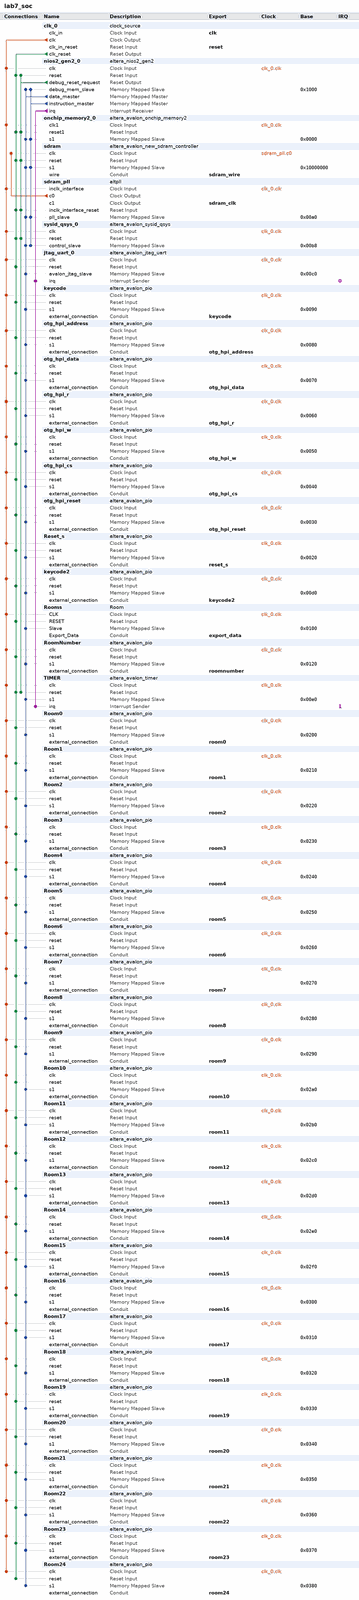
[diagram p0: system contents, whole]
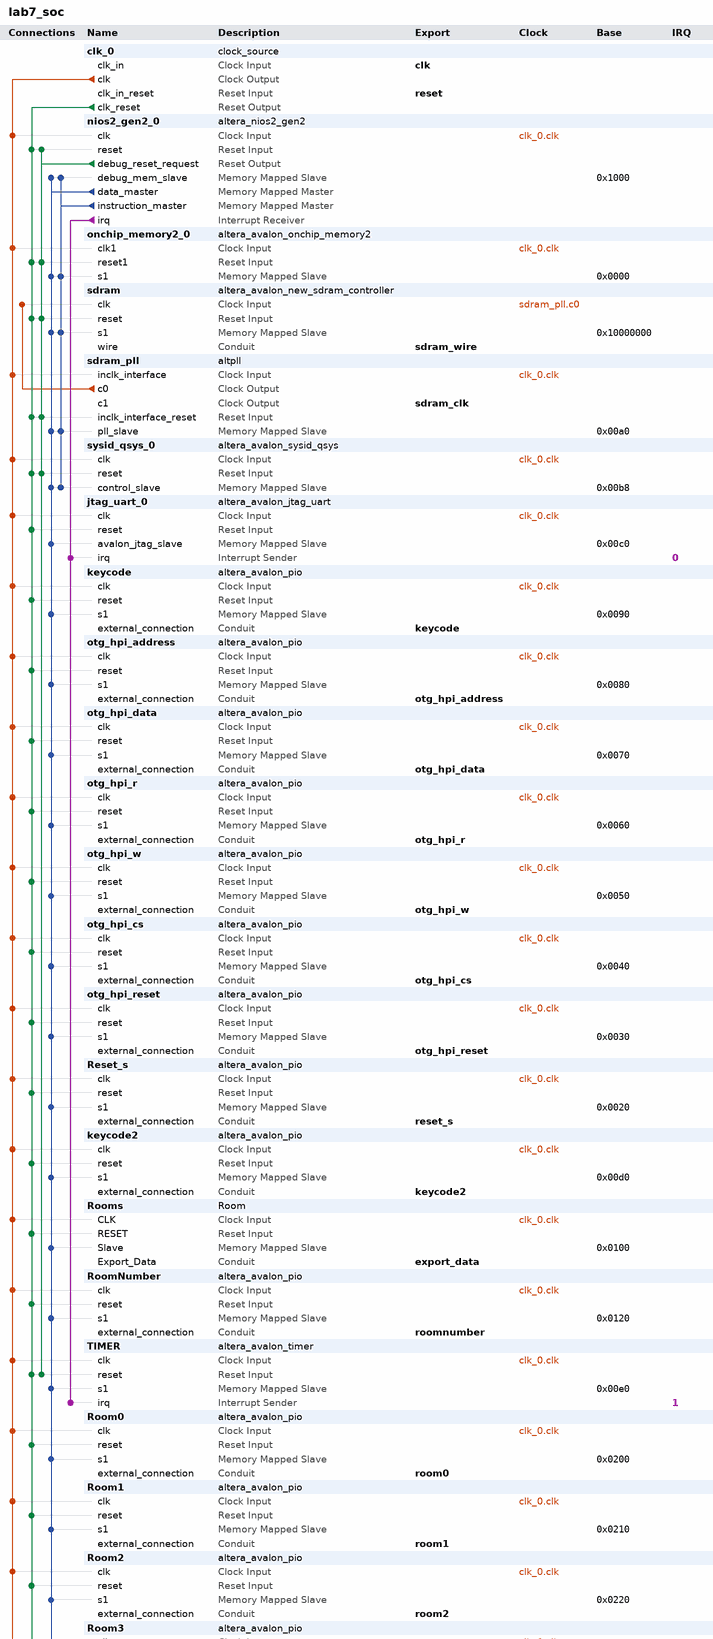
[diagram p1: system contents, upper part]
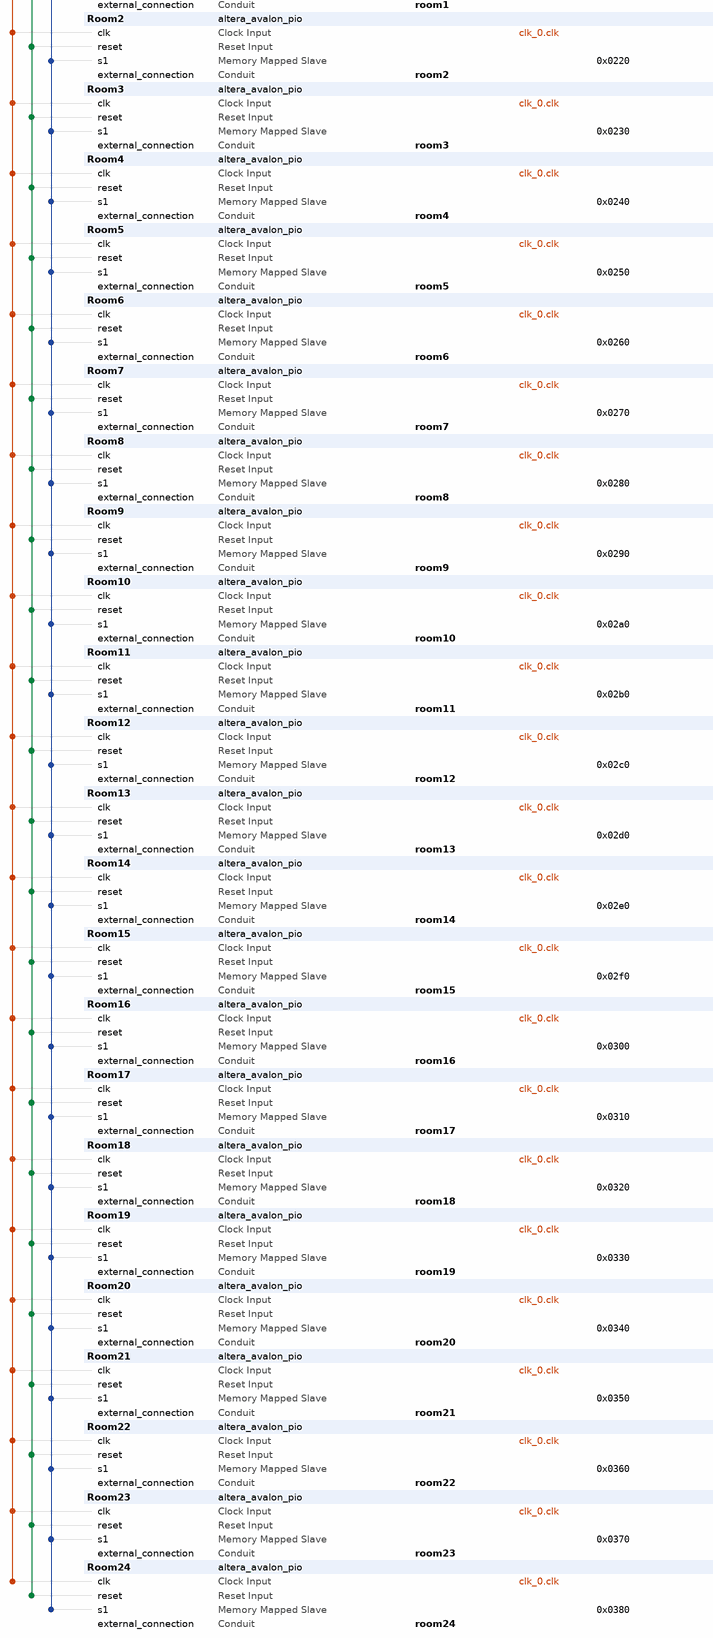
[diagram p2: system contents, lower part]
# Platform Designer (Qsys) system lab7_soc, Cyclone IV E EP4CE115F29C7
# Parameters at their usual value, and those the tool derives, are not listed.
package require -exact qsys 18.0
create_system lab7_soc
set_project_property DEVICE_FAMILY {Cyclone IV E}
set_project_property DEVICE EP4CE115F29C7

add_instance clk_0 clock_source 18.0
set_instance_parameter_value clk_0 clockFrequency 50000000

add_instance nios2_gen2_0 altera_nios2_gen2 18.0
set_instance_parameter_value nios2_gen2_0 dcache_size 2048
set_instance_parameter_value nios2_gen2_0 exceptionSlave sdram.s1
set_instance_parameter_value nios2_gen2_0 icache_size 4096
set_instance_parameter_value nios2_gen2_0 impl Tiny
set_instance_parameter_value nios2_gen2_0 resetSlave sdram.s1

add_instance onchip_memory2_0 altera_avalon_onchip_memory2 18.0
set_instance_parameter_value onchip_memory2_0 dataWidth 32
set_instance_parameter_value onchip_memory2_0 dualPort false
set_instance_parameter_value onchip_memory2_0 initMemContent true
set_instance_parameter_value onchip_memory2_0 initializationFileName onchip_mem.hex
set_instance_parameter_value onchip_memory2_0 memorySize 16

add_instance sdram altera_avalon_new_sdram_controller 18.0
set_instance_parameter_value sdram TAC 5.5
set_instance_parameter_value sdram TRCD 20.0
set_instance_parameter_value sdram TRP 20.0
set_instance_parameter_value sdram casLatency 3
set_instance_parameter_value sdram columnWidth 10
set_instance_parameter_value sdram dataWidth 32
set_instance_parameter_value sdram generateSimulationModel false
set_instance_parameter_value sdram model single_Micron_MT48LC4M32B2_7_chip
set_instance_parameter_value sdram numberOfBanks 4
set_instance_parameter_value sdram numberOfChipSelects 1
set_instance_parameter_value sdram powerUpDelay 200.0
set_instance_parameter_value sdram refreshPeriod 7.8125
set_instance_parameter_value sdram rowWidth 13

add_instance sdram_pll altpll 18.0
set_instance_parameter_value sdram_pll CLK0_DIVIDE_BY 1
set_instance_parameter_value sdram_pll CLK0_MULTIPLY_BY 1
set_instance_parameter_value sdram_pll CLK1_DIVIDE_BY 1
set_instance_parameter_value sdram_pll CLK1_DUTY_CYCLE 50
set_instance_parameter_value sdram_pll CLK1_MULTIPLY_BY 1
set_instance_parameter_value sdram_pll CLK1_PHASE_SHIFT -3000
set_instance_parameter_value sdram_pll INCLK0_INPUT_FREQUENCY 20000
set_instance_parameter_value sdram_pll PORT_ARESET PORT_UNUSED
set_instance_parameter_value sdram_pll PORT_LOCKED PORT_UNUSED
set_instance_parameter_value sdram_pll PORT_clk1 PORT_USED
set_instance_parameter_value sdram_pll PORT_clk2 PORT_UNUSED
set_instance_parameter_value sdram_pll PORT_clk3 PORT_UNUSED

add_instance sysid_qsys_0 altera_avalon_sysid_qsys 18.0
set_instance_parameter_value sysid_qsys_0 id 0

add_instance jtag_uart_0 altera_avalon_jtag_uart 18.0
set_instance_parameter_value jtag_uart_0 simInteractiveOptions NO_INTERACTIVE_WINDOWS

add_instance keycode altera_avalon_pio 18.0
set_instance_parameter_value keycode direction Output
set_instance_parameter_value keycode width 8

add_instance otg_hpi_address altera_avalon_pio 18.0
set_instance_parameter_value otg_hpi_address direction Output
set_instance_parameter_value otg_hpi_address width 2

add_instance otg_hpi_data altera_avalon_pio 18.0
set_instance_parameter_value otg_hpi_data direction InOut
set_instance_parameter_value otg_hpi_data width 16

add_instance otg_hpi_r altera_avalon_pio 18.0
set_instance_parameter_value otg_hpi_r direction Output
set_instance_parameter_value otg_hpi_r width 1

add_instance otg_hpi_w altera_avalon_pio 18.0
set_instance_parameter_value otg_hpi_w direction Output
set_instance_parameter_value otg_hpi_w width 1

add_instance otg_hpi_cs altera_avalon_pio 18.0
set_instance_parameter_value otg_hpi_cs direction Output
set_instance_parameter_value otg_hpi_cs width 1

add_instance otg_hpi_reset altera_avalon_pio 18.0
set_instance_parameter_value otg_hpi_reset direction Output
set_instance_parameter_value otg_hpi_reset width 1

add_instance Reset_s altera_avalon_pio 18.0
set_instance_parameter_value Reset_s direction Input
set_instance_parameter_value Reset_s width 1

add_instance keycode2 altera_avalon_pio 18.0
set_instance_parameter_value keycode2 direction Output
set_instance_parameter_value keycode2 width 8

add_instance Rooms Room 1.0

add_instance RoomNumber altera_avalon_pio 18.0
set_instance_parameter_value RoomNumber direction Output
set_instance_parameter_value RoomNumber width 8

add_instance TIMER altera_avalon_timer 18.0
set_instance_parameter_value TIMER period 1
set_instance_parameter_value TIMER periodUnits MSEC

add_instance Room0 altera_avalon_pio 18.0
set_instance_parameter_value Room0 direction Output
set_instance_parameter_value Room0 width 8

add_instance Room1 altera_avalon_pio 18.0
set_instance_parameter_value Room1 direction Output
set_instance_parameter_value Room1 width 8

add_instance Room2 altera_avalon_pio 18.0
set_instance_parameter_value Room2 direction Output
set_instance_parameter_value Room2 width 8

add_instance Room3 altera_avalon_pio 18.0
set_instance_parameter_value Room3 direction Output
set_instance_parameter_value Room3 width 8

add_instance Room4 altera_avalon_pio 18.0
set_instance_parameter_value Room4 direction Output
set_instance_parameter_value Room4 width 8

add_instance Room5 altera_avalon_pio 18.0
set_instance_parameter_value Room5 direction Output
set_instance_parameter_value Room5 width 8

add_instance Room6 altera_avalon_pio 18.0
set_instance_parameter_value Room6 direction Output
set_instance_parameter_value Room6 width 8

add_instance Room7 altera_avalon_pio 18.0
set_instance_parameter_value Room7 direction Output
set_instance_parameter_value Room7 width 8

add_instance Room8 altera_avalon_pio 18.0
set_instance_parameter_value Room8 direction Output
set_instance_parameter_value Room8 width 8

add_instance Room9 altera_avalon_pio 18.0
set_instance_parameter_value Room9 direction Output
set_instance_parameter_value Room9 width 8

add_instance Room10 altera_avalon_pio 18.0
set_instance_parameter_value Room10 direction Output
set_instance_parameter_value Room10 width 8

add_instance Room11 altera_avalon_pio 18.0
set_instance_parameter_value Room11 direction Output
set_instance_parameter_value Room11 width 8

add_instance Room12 altera_avalon_pio 18.0
set_instance_parameter_value Room12 direction Output
set_instance_parameter_value Room12 width 8

add_instance Room13 altera_avalon_pio 18.0
set_instance_parameter_value Room13 direction Output
set_instance_parameter_value Room13 width 8

add_instance Room14 altera_avalon_pio 18.0
set_instance_parameter_value Room14 direction Output
set_instance_parameter_value Room14 width 8

add_instance Room15 altera_avalon_pio 18.0
set_instance_parameter_value Room15 direction Output
set_instance_parameter_value Room15 width 8

add_instance Room16 altera_avalon_pio 18.0
set_instance_parameter_value Room16 direction Output
set_instance_parameter_value Room16 width 8

add_instance Room17 altera_avalon_pio 18.0
set_instance_parameter_value Room17 direction Output
set_instance_parameter_value Room17 width 8

add_instance Room18 altera_avalon_pio 18.0
set_instance_parameter_value Room18 direction Output
set_instance_parameter_value Room18 width 8

add_instance Room19 altera_avalon_pio 18.0
set_instance_parameter_value Room19 direction Output
set_instance_parameter_value Room19 width 8

add_instance Room20 altera_avalon_pio 18.0
set_instance_parameter_value Room20 direction Output
set_instance_parameter_value Room20 width 8

add_instance Room21 altera_avalon_pio 18.0
set_instance_parameter_value Room21 direction Output
set_instance_parameter_value Room21 width 8

add_instance Room22 altera_avalon_pio 18.0
set_instance_parameter_value Room22 direction Output
set_instance_parameter_value Room22 width 8

add_instance Room23 altera_avalon_pio 18.0
set_instance_parameter_value Room23 direction Output
set_instance_parameter_value Room23 width 8

add_instance Room24 altera_avalon_pio 18.0
set_instance_parameter_value Room24 direction Output
set_instance_parameter_value Room24 width 8

# connections
add_connection clk_0.clk jtag_uart_0.clk clock
add_connection clk_0.clk keycode2.clk clock
add_connection clk_0.clk keycode.clk clock
add_connection clk_0.clk nios2_gen2_0.clk clock
add_connection clk_0.clk onchip_memory2_0.clk1 clock
add_connection clk_0.clk otg_hpi_address.clk clock
add_connection clk_0.clk otg_hpi_cs.clk clock
add_connection clk_0.clk otg_hpi_data.clk clock
add_connection clk_0.clk otg_hpi_r.clk clock
add_connection clk_0.clk otg_hpi_reset.clk clock
add_connection clk_0.clk otg_hpi_w.clk clock
add_connection clk_0.clk Reset_s.clk clock
add_connection clk_0.clk Room0.clk clock
add_connection clk_0.clk Room1.clk clock
add_connection clk_0.clk Room2.clk clock
add_connection clk_0.clk Room3.clk clock
add_connection clk_0.clk Room4.clk clock
add_connection clk_0.clk Room5.clk clock
add_connection clk_0.clk Room6.clk clock
add_connection clk_0.clk Room7.clk clock
add_connection clk_0.clk Room8.clk clock
add_connection clk_0.clk Room9.clk clock
add_connection clk_0.clk Room10.clk clock
add_connection clk_0.clk Room11.clk clock
add_connection clk_0.clk Room12.clk clock
add_connection clk_0.clk Room13.clk clock
add_connection clk_0.clk Room14.clk clock
add_connection clk_0.clk Room15.clk clock
add_connection clk_0.clk Room16.clk clock
add_connection clk_0.clk Room17.clk clock
add_connection clk_0.clk Room18.clk clock
add_connection clk_0.clk Room19.clk clock
add_connection clk_0.clk Room20.clk clock
add_connection clk_0.clk Room21.clk clock
add_connection clk_0.clk Room22.clk clock
add_connection clk_0.clk Room23.clk clock
add_connection clk_0.clk Room24.clk clock
add_connection clk_0.clk RoomNumber.clk clock
add_connection clk_0.clk Rooms.CLK clock
add_connection clk_0.clk sdram_pll.inclk_interface clock
add_connection clk_0.clk sysid_qsys_0.clk clock
add_connection clk_0.clk TIMER.clk clock
add_connection sdram_pll.c0 sdram.clk clock
add_connection clk_0.clk_reset jtag_uart_0.reset reset
add_connection clk_0.clk_reset keycode2.reset reset
add_connection clk_0.clk_reset keycode.reset reset
add_connection clk_0.clk_reset nios2_gen2_0.reset reset
add_connection clk_0.clk_reset onchip_memory2_0.reset1 reset
add_connection clk_0.clk_reset otg_hpi_address.reset reset
add_connection clk_0.clk_reset otg_hpi_cs.reset reset
add_connection clk_0.clk_reset otg_hpi_data.reset reset
add_connection clk_0.clk_reset otg_hpi_r.reset reset
add_connection clk_0.clk_reset otg_hpi_reset.reset reset
add_connection clk_0.clk_reset otg_hpi_w.reset reset
add_connection clk_0.clk_reset Reset_s.reset reset
add_connection clk_0.clk_reset Room0.reset reset
add_connection clk_0.clk_reset Room1.reset reset
add_connection clk_0.clk_reset Room2.reset reset
add_connection clk_0.clk_reset Room3.reset reset
add_connection clk_0.clk_reset Room4.reset reset
add_connection clk_0.clk_reset Room5.reset reset
add_connection clk_0.clk_reset Room6.reset reset
add_connection clk_0.clk_reset Room7.reset reset
add_connection clk_0.clk_reset Room8.reset reset
add_connection clk_0.clk_reset Room9.reset reset
add_connection clk_0.clk_reset Room10.reset reset
add_connection clk_0.clk_reset Room11.reset reset
add_connection clk_0.clk_reset Room12.reset reset
add_connection clk_0.clk_reset Room13.reset reset
add_connection clk_0.clk_reset Room14.reset reset
add_connection clk_0.clk_reset Room15.reset reset
add_connection clk_0.clk_reset Room16.reset reset
add_connection clk_0.clk_reset Room17.reset reset
add_connection clk_0.clk_reset Room18.reset reset
add_connection clk_0.clk_reset Room19.reset reset
add_connection clk_0.clk_reset Room20.reset reset
add_connection clk_0.clk_reset Room21.reset reset
add_connection clk_0.clk_reset Room22.reset reset
add_connection clk_0.clk_reset Room23.reset reset
add_connection clk_0.clk_reset Room24.reset reset
add_connection clk_0.clk_reset RoomNumber.reset reset
add_connection clk_0.clk_reset Rooms.RESET reset
add_connection clk_0.clk_reset sdram.reset reset
add_connection clk_0.clk_reset sdram_pll.inclk_interface_reset reset
add_connection clk_0.clk_reset sysid_qsys_0.reset reset
add_connection clk_0.clk_reset TIMER.reset reset
add_connection nios2_gen2_0.debug_reset_request nios2_gen2_0.reset reset
add_connection nios2_gen2_0.debug_reset_request onchip_memory2_0.reset1 reset
add_connection nios2_gen2_0.debug_reset_request sdram.reset reset
add_connection nios2_gen2_0.debug_reset_request sdram_pll.inclk_interface_reset reset
add_connection nios2_gen2_0.debug_reset_request sysid_qsys_0.reset reset
add_connection nios2_gen2_0.debug_reset_request TIMER.reset reset
add_connection nios2_gen2_0.data_master jtag_uart_0.avalon_jtag_slave avalon
set_connection_parameter_value nios2_gen2_0.data_master/jtag_uart_0.avalon_jtag_slave baseAddress 0x00c0
add_connection nios2_gen2_0.data_master keycode2.s1 avalon
set_connection_parameter_value nios2_gen2_0.data_master/keycode2.s1 baseAddress 0x00d0
add_connection nios2_gen2_0.data_master keycode.s1 avalon
set_connection_parameter_value nios2_gen2_0.data_master/keycode.s1 baseAddress 0x0090
add_connection nios2_gen2_0.data_master nios2_gen2_0.debug_mem_slave avalon
set_connection_parameter_value nios2_gen2_0.data_master/nios2_gen2_0.debug_mem_slave baseAddress 0x1000
add_connection nios2_gen2_0.data_master onchip_memory2_0.s1 avalon
set_connection_parameter_value nios2_gen2_0.data_master/onchip_memory2_0.s1 baseAddress 0x0000
add_connection nios2_gen2_0.data_master otg_hpi_address.s1 avalon
set_connection_parameter_value nios2_gen2_0.data_master/otg_hpi_address.s1 baseAddress 0x0080
add_connection nios2_gen2_0.data_master otg_hpi_cs.s1 avalon
set_connection_parameter_value nios2_gen2_0.data_master/otg_hpi_cs.s1 baseAddress 0x0040
add_connection nios2_gen2_0.data_master otg_hpi_data.s1 avalon
set_connection_parameter_value nios2_gen2_0.data_master/otg_hpi_data.s1 baseAddress 0x0070
add_connection nios2_gen2_0.data_master otg_hpi_r.s1 avalon
set_connection_parameter_value nios2_gen2_0.data_master/otg_hpi_r.s1 baseAddress 0x0060
add_connection nios2_gen2_0.data_master otg_hpi_reset.s1 avalon
set_connection_parameter_value nios2_gen2_0.data_master/otg_hpi_reset.s1 baseAddress 0x0030
add_connection nios2_gen2_0.data_master otg_hpi_w.s1 avalon
set_connection_parameter_value nios2_gen2_0.data_master/otg_hpi_w.s1 baseAddress 0x0050
add_connection nios2_gen2_0.data_master Reset_s.s1 avalon
set_connection_parameter_value nios2_gen2_0.data_master/Reset_s.s1 baseAddress 0x0020
add_connection nios2_gen2_0.data_master Room0.s1 avalon
set_connection_parameter_value nios2_gen2_0.data_master/Room0.s1 baseAddress 0x0200
add_connection nios2_gen2_0.data_master Room1.s1 avalon
set_connection_parameter_value nios2_gen2_0.data_master/Room1.s1 baseAddress 0x0210
add_connection nios2_gen2_0.data_master Room2.s1 avalon
set_connection_parameter_value nios2_gen2_0.data_master/Room2.s1 baseAddress 0x0220
add_connection nios2_gen2_0.data_master Room3.s1 avalon
set_connection_parameter_value nios2_gen2_0.data_master/Room3.s1 baseAddress 0x0230
add_connection nios2_gen2_0.data_master Room4.s1 avalon
set_connection_parameter_value nios2_gen2_0.data_master/Room4.s1 baseAddress 0x0240
add_connection nios2_gen2_0.data_master Room5.s1 avalon
set_connection_parameter_value nios2_gen2_0.data_master/Room5.s1 baseAddress 0x0250
add_connection nios2_gen2_0.data_master Room6.s1 avalon
set_connection_parameter_value nios2_gen2_0.data_master/Room6.s1 baseAddress 0x0260
add_connection nios2_gen2_0.data_master Room7.s1 avalon
set_connection_parameter_value nios2_gen2_0.data_master/Room7.s1 baseAddress 0x0270
add_connection nios2_gen2_0.data_master Room8.s1 avalon
set_connection_parameter_value nios2_gen2_0.data_master/Room8.s1 baseAddress 0x0280
add_connection nios2_gen2_0.data_master Room9.s1 avalon
set_connection_parameter_value nios2_gen2_0.data_master/Room9.s1 baseAddress 0x0290
add_connection nios2_gen2_0.data_master Room10.s1 avalon
set_connection_parameter_value nios2_gen2_0.data_master/Room10.s1 baseAddress 0x02a0
add_connection nios2_gen2_0.data_master Room11.s1 avalon
set_connection_parameter_value nios2_gen2_0.data_master/Room11.s1 baseAddress 0x02b0
add_connection nios2_gen2_0.data_master Room12.s1 avalon
set_connection_parameter_value nios2_gen2_0.data_master/Room12.s1 baseAddress 0x02c0
add_connection nios2_gen2_0.data_master Room13.s1 avalon
set_connection_parameter_value nios2_gen2_0.data_master/Room13.s1 baseAddress 0x02d0
add_connection nios2_gen2_0.data_master Room14.s1 avalon
set_connection_parameter_value nios2_gen2_0.data_master/Room14.s1 baseAddress 0x02e0
add_connection nios2_gen2_0.data_master Room15.s1 avalon
set_connection_parameter_value nios2_gen2_0.data_master/Room15.s1 baseAddress 0x02f0
add_connection nios2_gen2_0.data_master Room16.s1 avalon
set_connection_parameter_value nios2_gen2_0.data_master/Room16.s1 baseAddress 0x0300
add_connection nios2_gen2_0.data_master Room17.s1 avalon
set_connection_parameter_value nios2_gen2_0.data_master/Room17.s1 baseAddress 0x0310
add_connection nios2_gen2_0.data_master Room18.s1 avalon
set_connection_parameter_value nios2_gen2_0.data_master/Room18.s1 baseAddress 0x0320
add_connection nios2_gen2_0.data_master Room19.s1 avalon
set_connection_parameter_value nios2_gen2_0.data_master/Room19.s1 baseAddress 0x0330
add_connection nios2_gen2_0.data_master Room20.s1 avalon
set_connection_parameter_value nios2_gen2_0.data_master/Room20.s1 baseAddress 0x0340
add_connection nios2_gen2_0.data_master Room21.s1 avalon
set_connection_parameter_value nios2_gen2_0.data_master/Room21.s1 baseAddress 0x0350
add_connection nios2_gen2_0.data_master Room22.s1 avalon
set_connection_parameter_value nios2_gen2_0.data_master/Room22.s1 baseAddress 0x0360
add_connection nios2_gen2_0.data_master Room23.s1 avalon
set_connection_parameter_value nios2_gen2_0.data_master/Room23.s1 baseAddress 0x0370
add_connection nios2_gen2_0.data_master Room24.s1 avalon
set_connection_parameter_value nios2_gen2_0.data_master/Room24.s1 baseAddress 0x0380
add_connection nios2_gen2_0.data_master RoomNumber.s1 avalon
set_connection_parameter_value nios2_gen2_0.data_master/RoomNumber.s1 baseAddress 0x0120
add_connection nios2_gen2_0.data_master Rooms.Slave avalon
set_connection_parameter_value nios2_gen2_0.data_master/Rooms.Slave baseAddress 0x0100
add_connection nios2_gen2_0.data_master sdram.s1 avalon
set_connection_parameter_value nios2_gen2_0.data_master/sdram.s1 baseAddress 0x10000000
add_connection nios2_gen2_0.data_master sdram_pll.pll_slave avalon
set_connection_parameter_value nios2_gen2_0.data_master/sdram_pll.pll_slave baseAddress 0x00a0
add_connection nios2_gen2_0.data_master sysid_qsys_0.control_slave avalon
set_connection_parameter_value nios2_gen2_0.data_master/sysid_qsys_0.control_slave baseAddress 0x00b8
add_connection nios2_gen2_0.data_master TIMER.s1 avalon
set_connection_parameter_value nios2_gen2_0.data_master/TIMER.s1 baseAddress 0x00e0
add_connection nios2_gen2_0.instruction_master nios2_gen2_0.debug_mem_slave avalon
set_connection_parameter_value nios2_gen2_0.instruction_master/nios2_gen2_0.debug_mem_slave baseAddress 0x1000
add_connection nios2_gen2_0.instruction_master onchip_memory2_0.s1 avalon
set_connection_parameter_value nios2_gen2_0.instruction_master/onchip_memory2_0.s1 baseAddress 0x0000
add_connection nios2_gen2_0.instruction_master sdram.s1 avalon
set_connection_parameter_value nios2_gen2_0.instruction_master/sdram.s1 baseAddress 0x10000000
add_connection nios2_gen2_0.instruction_master sdram_pll.pll_slave avalon
set_connection_parameter_value nios2_gen2_0.instruction_master/sdram_pll.pll_slave baseAddress 0x00a0
add_connection nios2_gen2_0.instruction_master sysid_qsys_0.control_slave avalon
set_connection_parameter_value nios2_gen2_0.instruction_master/sysid_qsys_0.control_slave baseAddress 0x00b8
add_connection nios2_gen2_0.irq jtag_uart_0.irq interrupt
set_connection_parameter_value nios2_gen2_0.irq/jtag_uart_0.irq irqNumber 0
add_connection nios2_gen2_0.irq TIMER.irq interrupt
set_connection_parameter_value nios2_gen2_0.irq/TIMER.irq irqNumber 1

# exported interfaces
add_interface clk clock sink
set_interface_property clk EXPORT_OF clk_0.clk_in
add_interface export_data conduit end
set_interface_property export_data EXPORT_OF Rooms.Export_Data
add_interface keycode conduit end
set_interface_property keycode EXPORT_OF keycode.external_connection
add_interface keycode2 conduit end
set_interface_property keycode2 EXPORT_OF keycode2.external_connection
add_interface otg_hpi_address conduit end
set_interface_property otg_hpi_address EXPORT_OF otg_hpi_address.external_connection
add_interface otg_hpi_cs conduit end
set_interface_property otg_hpi_cs EXPORT_OF otg_hpi_cs.external_connection
add_interface otg_hpi_data conduit end
set_interface_property otg_hpi_data EXPORT_OF otg_hpi_data.external_connection
add_interface otg_hpi_r conduit end
set_interface_property otg_hpi_r EXPORT_OF otg_hpi_r.external_connection
add_interface otg_hpi_reset conduit end
set_interface_property otg_hpi_reset EXPORT_OF otg_hpi_reset.external_connection
add_interface otg_hpi_w conduit end
set_interface_property otg_hpi_w EXPORT_OF otg_hpi_w.external_connection
add_interface reset reset sink
set_interface_property reset EXPORT_OF clk_0.clk_in_reset
add_interface reset_s conduit end
set_interface_property reset_s EXPORT_OF Reset_s.external_connection
add_interface room0 conduit end
set_interface_property room0 EXPORT_OF Room0.external_connection
add_interface room1 conduit end
set_interface_property room1 EXPORT_OF Room1.external_connection
add_interface room10 conduit end
set_interface_property room10 EXPORT_OF Room10.external_connection
add_interface room11 conduit end
set_interface_property room11 EXPORT_OF Room11.external_connection
add_interface room12 conduit end
set_interface_property room12 EXPORT_OF Room12.external_connection
add_interface room13 conduit end
set_interface_property room13 EXPORT_OF Room13.external_connection
add_interface room14 conduit end
set_interface_property room14 EXPORT_OF Room14.external_connection
add_interface room15 conduit end
set_interface_property room15 EXPORT_OF Room15.external_connection
add_interface room16 conduit end
set_interface_property room16 EXPORT_OF Room16.external_connection
add_interface room17 conduit end
set_interface_property room17 EXPORT_OF Room17.external_connection
add_interface room18 conduit end
set_interface_property room18 EXPORT_OF Room18.external_connection
add_interface room19 conduit end
set_interface_property room19 EXPORT_OF Room19.external_connection
add_interface room2 conduit end
set_interface_property room2 EXPORT_OF Room2.external_connection
add_interface room20 conduit end
set_interface_property room20 EXPORT_OF Room20.external_connection
add_interface room21 conduit end
set_interface_property room21 EXPORT_OF Room21.external_connection
add_interface room22 conduit end
set_interface_property room22 EXPORT_OF Room22.external_connection
add_interface room23 conduit end
set_interface_property room23 EXPORT_OF Room23.external_connection
add_interface room24 conduit end
set_interface_property room24 EXPORT_OF Room24.external_connection
add_interface room3 conduit end
set_interface_property room3 EXPORT_OF Room3.external_connection
add_interface room4 conduit end
set_interface_property room4 EXPORT_OF Room4.external_connection
add_interface room5 conduit end
set_interface_property room5 EXPORT_OF Room5.external_connection
add_interface room6 conduit end
set_interface_property room6 EXPORT_OF Room6.external_connection
add_interface room7 conduit end
set_interface_property room7 EXPORT_OF Room7.external_connection
add_interface room8 conduit end
set_interface_property room8 EXPORT_OF Room8.external_connection
add_interface room9 conduit end
set_interface_property room9 EXPORT_OF Room9.external_connection
add_interface roomnumber conduit end
set_interface_property roomnumber EXPORT_OF RoomNumber.external_connection
add_interface sdram_clk clock source
set_interface_property sdram_clk EXPORT_OF sdram_pll.c1
add_interface sdram_wire conduit end
set_interface_property sdram_wire EXPORT_OF sdram.wire

set_interconnect_requirement {$system} qsys_mm.clockCrossingAdapter HANDSHAKE
set_interconnect_requirement {$system} qsys_mm.enableEccProtection FALSE
set_interconnect_requirement {$system} qsys_mm.insertDefaultSlave FALSE
set_interconnect_requirement {$system} qsys_mm.maxAdditionalLatency 1

save_system lab7_soc.qsys
